# Altium schematic sheet Sheet1.SchDoc
size 420 x 297 mm; Address1: Address1; Address2: Address2; Address3: Address3; Address4: Address4; DocumentNumber: АБВГ.123456.001 Э3; SheetNumber: 1; Scale: 1:1; DocumentType: Схема электрическая принципиальная; FirstReferrence: АБВГ.123456.001
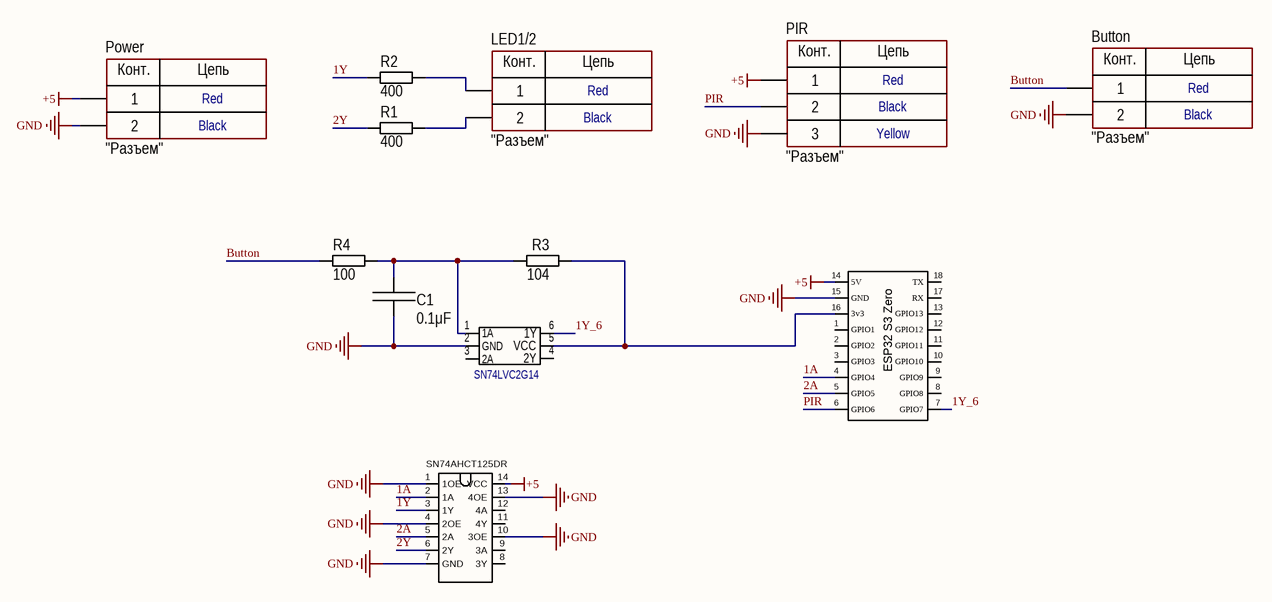
[diagram p0: Sheet1.SchDoc]

## Parts
*  SN74AHCT125DR  [14-SOIC]  (value not drawn)
Button  CommentText: "Разъем"  [CON: CWF-2]
C1  value 0.1μF  [CAP: 0805]
LED1/2  CommentText: "Разъем"  [CON: CWF-2]
PIR  CommentText: "Разъем"  [CON: CWF-3]
Power  CommentText: "Разъем"  [CON: CWF-2]
pp  ESP32 S3 Zero  [ESP32 S3 Zero]  (value not drawn)
R1  value 400  [RES: 0805]
R2  value 400  [RES: 0805]
R3  value 104  [RES: 0805]
R4  value 100  [RES: 0805]
SN74LVC2G14  Dual Schmitt-Trigger Inverter  [SOT23-6]  (value not drawn)

## Nets
+5: *.14(VCC) PIR.1 Power.1 pp.14(5V)
GND: *.1(1OE) *.4(2OE) *.7(GND) *.10(3OE) *.13(4OE) Button.2 C1.1 PIR.3 Power.2 pp.15(GND) SN74LVC2G14.2(GND)
1A: *.2(1A) pp.4(GPIO4)
1Y: *.3(1Y) R2.1
1Y_6: pp.7(GPIO7) SN74LVC2G14.6(1Y)
2A: *.5(2A) pp.5(GPIO5)
2Y: *.6(2Y) R1.1
Button: Button.1 R4.1
PIR: PIR.2 pp.6(GPIO6)
NetC1_2: C1.2 R3.2 R4.2 SN74LVC2G14.1(1A)
NetLED1/2_1: LED1/2.1 R2.2
NetLED1/2_2: LED1/2.2 R1.2
Netpp_16: pp.16(3v3) R3.1 SN74LVC2G14.5(VCC)

Not connected (* = marked no-connect by the designer): * 8(3Y) 9(3A) 11(4Y) 12(4A); pp 1(GPIO1) 2(GPIO2) 3(GPIO3) 8(GPIO8) 9(GPIO9) 10(GPIO10) 11(GPIO11) 12(GPIO12) 13(GPIO13) 17(RX) 18(TX); SN74LVC2G14 3(2A) 4(2Y)

## Notes on the sheet
- Перв. примен.
- Справ. №
- Подп. и дата
- Инв. № дубл.
- Взам. инв. №
- Разраб.
- Изм.
- Лист
- № докум.
- Подп.
- Дата
- Лит.
- Масса
- Масштаб
- Пров.
- Т.контр.
- Листов
- Инв. № подл.
- Утв.
- Н.контр.
- 2.106-A3
- Копировал
- Формат А3
- (in symbol CWF-2) Конт.; Цепь; Red; Black
- (in symbol CWF-3) Конт.; Цепь; Red; Black; Yellow

## Library data of the parts
Button LED1/2 Power = CWF-2: Manufacturer: Connfly; ValueManufacturerPartNumber: Connector, 2pin, 2.54mm, 250VAC, 3A; PartNumber: CWF-2R; TypeConnector: Connector; VoltageMax: 250VAC; Pitch: 2.54mm; CurrentMax: 3A; Multichannel: 2pin; HelpURL: https://www.chipdip.ru/product/cwf-2r-ds1069-2-mr
C1 = Ceramic_0805: Manufacturer: Yageo; PartNumber: CC0805KRX7R7BB104; ValueManufacturerPartNumber: Ceramic capacitor, 0.1μF, X7R, ±10%, 16V, 0805, -55...+125°C; TypeCapacitor: Ceramic capacitor; Tolerance: ±10%; TypeDielectric: X7R; Voltage: 16V; Package: 0805; HelpURL: https://www.digikey.com/product-detail/en/yageo/CC0805KRX7R7BB104/311-1142-1-ND/303052; Temperature: -55...+125°C
PIR = CWF-3: Manufacturer: Connfly; ValueManufacturerPartNumber: Connector, 2pin, 2.54mm, 250VAC, 3A; PartNumber: CWF-2R; TypeConnector: Connector; VoltageMax: 250VAC; Pitch: 2.54mm; CurrentMax: 3A; Multichannel: 2pin; HelpURL: https://www.chipdip.ru/product/cwf-2r-ds1069-2-mr
R1 R2 = Resistor_0805: Manufacturer: Yageo; PartNumber: RC0805JR-07100RL; ValueManufacturerPartNumber: Resistor film, 400, ±5%, 0805, 0.125W, -55...+125°C; TypeResistor: Resistor film; Power: 0.125W; Tolerance: ±5%; Package: 0805; HelpURL: https://www.digikey.com/product-detail/en/yageo/RC0805JR-07100RL/311-100ARCT-ND/731185; Temperature: -55...+125°C
R3 = Resistor_0805: Manufacturer: Yageo; PartNumber: RC0805JR-07100RL; ValueManufacturerPartNumber: Resistor film, 104, ±5%, 0805, 0.125W, -55...+125°C; TypeResistor: Resistor film; Power: 0.125W; Tolerance: ±5%; Package: 0805; HelpURL: https://www.digikey.com/product-detail/en/yageo/RC0805JR-07100RL/311-100ARCT-ND/731185; Temperature: -55...+125°C
R4 = Resistor_0805: Manufacturer: Yageo; PartNumber: RC0805JR-07100RL; ValueManufacturerPartNumber: Resistor film, 100, ±5%, 0805, 0.125W, -55...+125°C; TypeResistor: Resistor film; Power: 0.125W; Tolerance: ±5%; Package: 0805; HelpURL: https://www.digikey.com/product-detail/en/yageo/RC0805JR-07100RL/311-100ARCT-ND/731185; Temperature: -55...+125°C
SN74LVC2G14 = SN74LVC2G14DBVR: Invertor